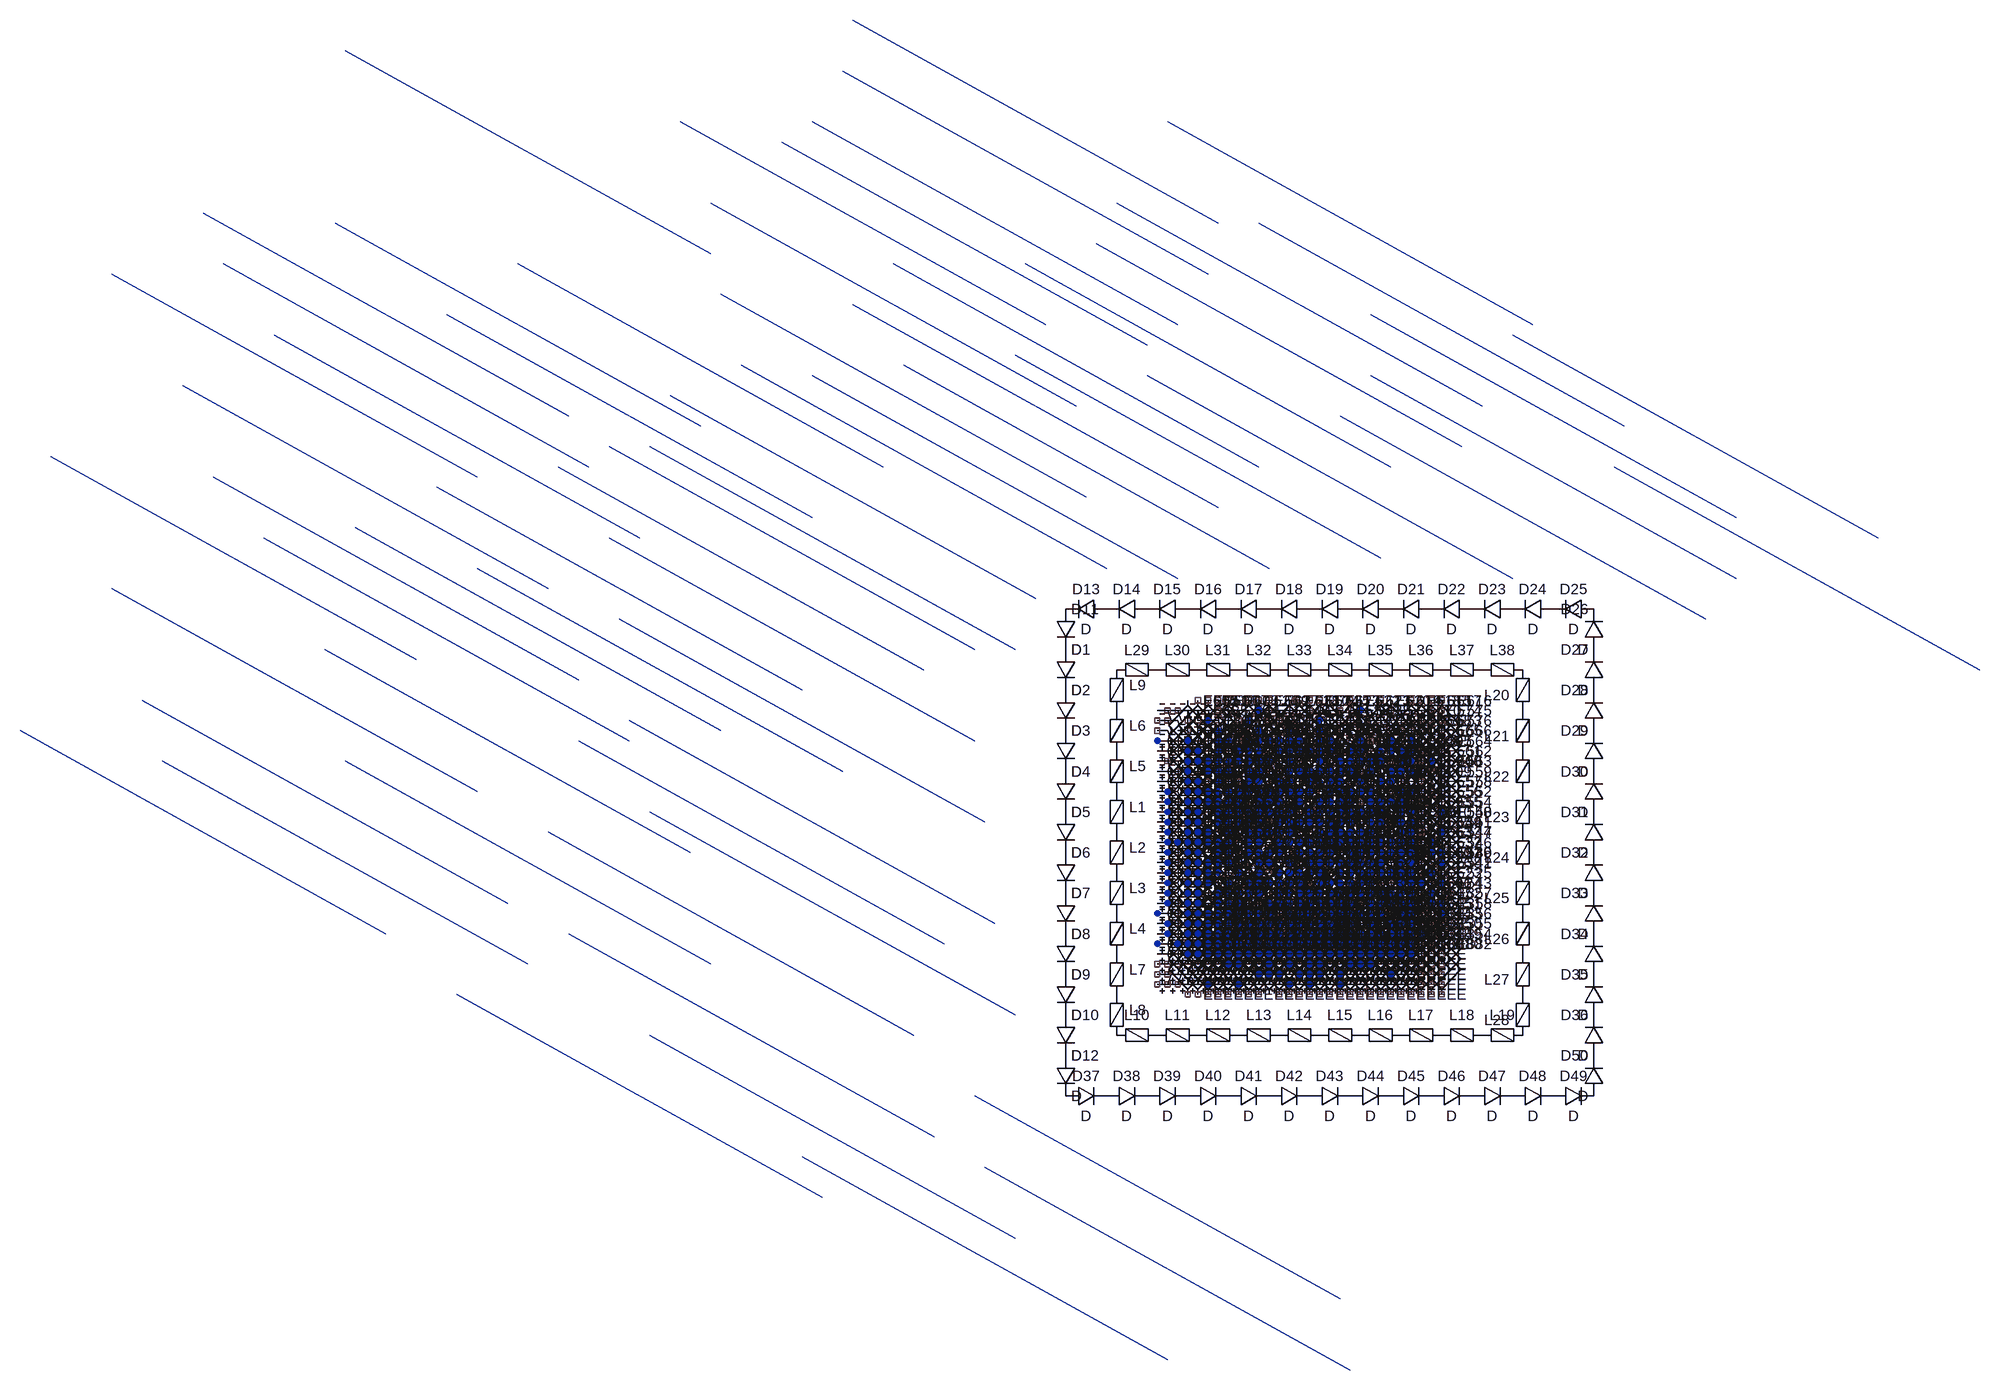
[diagram p0: schematic LT Spice Art.asc]
* LT Spice Art.asc
E1 P001 P002 NC_01 P003 E
E2 P004 P005 P006 P007 E
E3 P008 P009 P010 P011 E
E4 P012 P013 P014 P015 E
E5 P016 P017 P018 P019 E
E6 P020 P021 P022 P016 E
E7 P023 P024 P025 P026 E
E8 P027 P028 P029 P030 E
E9 P031 P032 P016 P033 E
E10 P034 P035 P036 P037 E
E11 P038 P039 NC_02 P040 E
E12 P041 P042 P043 P044 E
E13 P045 P046 P047 P048 E
E14 P049 P050 P051 P052 E
E15 P053 P054 P055 P056 E
E16 P057 P058 P059 P060 E
E17 P061 P062 P063 P064 E
E18 P065 P066 P067 P068 E
E19 P069 P010 P070 P071 E
E20 P029 P072 P073 P035 E
E21 P051 P074 P075 P076 E
E22 P042 P077 P078 P079 E
E23 P036 P080 P081 P082 E
E24 P035 P083 P080 P084 E
E25 P058 P085 P086 P022 E
E26 P039 P087 P088 P089 E
E27 P082 P090 P091 P092 E
E28 P040 P089 P093 P094 E
E29 P059 P086 P077 P095 E
E30 P019 P096 P097 P098 E
E31 P099 P100 P101 P102 E
E32 P103 P104 P098 P043 E
E33 P105 P095 P079 P106 E
E34 P107 P069 P108 P109 E
E35 P110 P111 P037 P112 E
E36 P113 P020 P060 P114 E
E37 P115 P109 P103 P041 E
E38 P116 P076 P038 P117 E
E39 P048 P118 P119 P120 E
E40 P121 P122 P106 P123 E
E41 P124 P125 P126 P127 E
E42 P128 P129 P130 P131 E
E43 P132 P133 P134 P135 E
E44 P124 P125 P126 P127 E
E45 P115 P109 P103 P041 E
E46 P136 P052 P116 P137 E
E47 P138 P139 P110 P140 E
E48 P141 P114 P121 P142 E
E49 P143 P112 P144 P132 E
E50 P127 P145 P129 P146 E
E51 P147 P019 P148 P149 E
E52 P117 P150 P040 P126 E
E53 P151 P120 P152 P153 E
E54 P123 P148 P154 P155 E
E55 P156 P094 P157 P130 E
E56 P044 P079 P158 P159 E
E57 P160 P161 P102 P162 E
E58 P163 P119 P164 P152 E
E59 P099 P100 P101 P102 E
E60 P043 P078 P165 P158 E
E61 P129 P166 P167 P168 E
E62 P152 P169 P170 P171 E
E63 P106 P172 P173 P154 E
E64 P174 P082 P175 P176 E
E65 P043 P078 P165 P158 E
E66 P169 P177 P178 P179 E
E67 P166 P180 P181 P182 E
E68 P078 P183 P184 P185 E
E69 P015 P186 P180 P187 E
E70 P015 P186 P180 P187 E
E71 P018 P188 P189 P097 E
E72 P084 P190 P090 P191 E
E73 P071 P192 P193 P077 E
E74 P071 P192 P193 P077 E
E75 P194 P195 P190 P196 E
E76 P194 P195 P190 P196 E
E77 P021 P197 P198 P017 E
E78 P025 P199 P200 P201 E
E79 P074 P202 P203 P063 E
E80 P204 P205 P206 P207 E
E81 P208 P209 P210 P211 E
E82 P212 P213 P202 P062 E
E83 P214 P215 P216 P199 E
E84 P214 P215 P216 P199 E
E85 P217 P218 P209 P214 E
E86 P219 P220 P221 P204 E
E87 P212 P213 P202 P062 E
E88 P222 P223 P224 P225 E
E89 P226 P227 P228 P219 E
E90 P229 P230 P009 P231 E
E91 P232 P233 P229 P005 E
E92 P234 P235 P214 P024 E
E93 P236 P208 P237 P238 E
E94 P239 P222 P240 P241 E
E95 P242 P217 P208 P243 E
E96 P244 P219 P245 P246 E
E97 P247 NC_03 P028 P236 E
E98 P027 P028 P029 P030 E
E99 P050 P212 P074 P061 E
E100 P248 P249 P024 P250 E
E101 P251 P252 P246 P253 E
E102 P253 P254 P046 P255 E
E103 P068 P008 P069 P256 E
E104 P006 P231 P011 P058 E
E105 P257 P258 P085 P021 E
E106 P257 P258 P085 P021 E
E107 P257 P258 P085 P021 E
E108 P032 P259 P017 P108 E
E109 P026 P260 P201 P002 E
E110 P246 P204 NC_04 P046 E
E111 P030 P237 P035 P111 E
E112 P261 P245 P064 P262 E
E113 P263 P243 P238 P054 E
E114 P264 P023 P054 P265 E
E115 P266 P261 P267 P268 E
E116 P265 P026 P269 P001 E
E117 P270 P271 P020 P031 E
E118 P272 P273 P068 P274 E
E119 P275 P276 P244 P251 E
E120 P277 P278 P241 P065 E
E121 P279 P280 P066 P273 E
E122 P281 P282 P252 P283 E
E123 P284 P285 P050 P286 E
E124 P287 P288 P286 P289 E
E125 P290 P284 P049 P291 E
E126 P292 P251 P293 P294 E
E127 P295 P113 P296 P141 E
E128 P297 P115 P298 P299 E
E129 P300 P127 P128 P301 E
E130 P302 P123 P303 P304 E
E131 P305 P152 P306 P307 E
E132 P308 P038 P120 P309 E
E133 P310 P255 P048 P308 E
E134 P311 P031 P114 P312 E
E135 P313 P117 P309 P314 E
E136 P315 P316 P001 P317 E
E137 P318 P319 P263 P264 E
E138 P320 P004 P274 P321 E
E139 P322 P263 P139 P053 E
E140 P323 P324 P325 P138 E
E141 P326 P293 P268 P327 E
E142 P328 P116 P308 P313 E
E143 P329 P001 P330 P331 E
E144 P332 P333 P041 P334 E
E145 P312 P033 P147 P298 E
E146 P317 P034 P003 P335 E
E147 P336 P196 P191 P337 E
E148 P035 P083 P080 P084 E
E149 P237 P210 P083 P194 E
E150 P194 P195 P190 P196 E
E151 P010 P338 P339 P192 E
E152 P192 P340 P341 P342 E
E153 P193 P341 P343 P183 E
E154 P344 P345 P346 P347 E
E155 P196 P348 P349 P344 E
E156 P350 P351 P352 P014 E
E157 P200 P353 P348 P354 E
E158 P355 P356 P357 P010 E
E159 P228 P358 P359 P221 E
E160 P360 P361 P220 P362 E
E161 P363 P364 P365 P240 E
E162 P276 P360 P219 P252 E
E163 P366 P367 P368 P369 E
E164 P081 P370 P369 P091 E
E165 P371 P372 P373 P374 E
E166 P093 P375 P376 P377 E
E167 P086 P378 P342 P379 E
E168 P202 P380 P381 P382 E
E169 P220 P383 P384 P205 E
E170 P385 P346 P374 NC_05 E
E171 P161 P081 P386 P175 E
E172 P123 P148 P154 P155 E
E173 P387 P388 P127 P389 E
E174 P265 P026 P269 P001 E
E175 P107 P069 P108 P109 E
E176 P046 P207 P390 P118 E
E177 P391 P200 P196 NC_06 E
E178 P012 P013 P014 P015 E
E179 P194 P195 P190 P196 E
E180 P073 P392 P393 P080 E
E181 P207 P394 P395 P396 E
E182 P085 P397 P378 P198 E
E183 P199 P398 P353 P399 E
E184 P221 P384 P400 P206 E
E185 P202 P380 P381 P382 E
E186 P401 P402 P398 P403 E
E187 P235 P404 P215 P401 E
E188 P405 P406 P407 P230 E
E189 P408 P409 P410 P411 E
E190 P411 P407 P356 P009 E
E191 P412 P413 P414 P415 E
E192 P248 P249 P024 P250 E
E193 P263 P243 P238 P054 E
E194 P253 P254 P046 P255 E
E195 P267 P064 P150 P125 E
E196 P114 P016 P122 P147 E
E197 P047 P390 P015 P119 E
E198 P016 P017 P018 P019 E
E199 P316 P029 P002 P034 E
E200 P324 P236 P030 P139 E
E201 P291 P286 P052 P266 E
E202 P416 P417 P270 P418 E
E203 P419 P420 P324 P322 E
E204 P290 P284 P049 P291 E
E205 P421 P422 P423 P416 E
E206 P421 P422 P423 P416 E
E207 P424 P425 P426 P419 E
E208 P427 P428 P284 P287 E
E209 P429 P430 P431 P426 E
E210 P432 P433 P242 P319 E
E211 P434 P435 P436 P050 E
E212 P254 P437 P207 P075 E
E213 P350 P351 P352 P014 E
E214 P393 P438 P367 P370 E
E215 P192 P340 P341 P342 E
E216 P206 P439 P440 P395 E
E217 P013 P440 P441 P186 E
E218 P344 P345 P346 P347 E
E219 P097 P442 P443 P444 E
E220 P174 P082 P175 P176 E
E221 P127 P145 P129 P146 E
E222 P298 P103 P149 P445 E
E223 P446 P121 P447 P302 E
E224 P446 P121 P447 P302 E
E225 P331 P003 P160 P448 E
E226 P449 P156 P450 P451 E
E227 P452 P153 P307 P453 E
E228 P109 P071 P104 P042 E
E229 P060 P022 P095 P122 E
E230 P037 P084 P082 P454 E
E231 P103 P104 P098 P043 E
E232 P133 P337 P455 P456 E
E233 P144 P454 P176 P134 E
E234 P445 P043 P457 P458 E
E235 P459 P102 P460 NC_07 E
E236 P132 P133 P134 P135 E
E237 P461 P309 P153 P449 E
E238 P462 P160 P459 P463 E
E239 P301 P146 P131 P464 E
E240 P465 P325 P317 P466 E
E241 P467 P468 P310 P328 E
E242 NC_08 P264 P053 P469 E
E243 P470 P426 NC_09 P323 E
E244 P471 NC_10 P264 P472 E
E245 P473 P065 P474 P475 E
E246 P272 P273 P068 P274 E
E247 P476 P434 P283 P049 E
E248 P287 P288 P286 P289 E
E249 P477 P281 P251 P478 E
E250 P325 P030 P034 P110 E
E251 P274 P006 P256 P057 E
E252 P274 P006 P256 P057 E
E253 P110 P111 P037 P112 E
E254 P055 P391 P336 NC_11 E
E255 P034 P035 P036 P037 E
E256 P032 P259 P017 P108 E
E257 P058 P085 P086 P022 E
E258 P390 P395 P186 P479 E
E259 P104 P193 P480 P078 E
E260 P095 P379 P481 P172 E
E261 P479 P482 P483 P177 E
E262 P354 P484 P345 P366 E
E263 P198 P485 P486 P188 E
E264 P083 P487 P488 P190 E
E265 P221 P384 P400 P206 E
E266 P258 P489 P397 P197 E
E267 P490 P491 P492 P210 E
E268 P235 P404 P215 P401 E
E269 P228 P358 P359 P221 E
E270 P355 P356 P357 P010 E
E271 P221 P384 P400 P206 E
E272 P231 P493 P494 P085 E
E273 P204 P205 P206 P207 E
E274 P062 P359 P382 P495 E
E275 P437 P496 P394 P203 E
E276 P072 P492 P392 P083 E
E277 P211 P216 P195 P200 E
E278 P260 P403 P399 P073 E
E279 P011 P494 P192 P086 E
E280 P085 P397 P378 P198 E
E281 P259 P357 P497 P070 E
E282 P083 P487 P488 P190 E
E283 P070 P339 P498 P193 E
E284 P354 P484 P345 P366 E
E285 P354 P484 P345 P366 E
E286 P193 P341 P343 P183 E
E287 P088 P499 P500 P375 E
E288 P189 P501 P502 P443 E
E289 P347 P368 NC_12 P503 E
E290 P371 P372 P373 P374 E
E291 P180 P504 P505 P506 E
E292 P375 P507 P508 P509 E
E293 P183 P510 P511 P512 E
E294 P090 P513 P514 P371 E
E295 P186 P515 P504 P483 E
E296 P188 P516 P501 P442 E
E297 P190 P517 P513 P349 E
E298 P087 P518 P499 P352 E
E299 P083 P487 P488 P190 E
E300 P399 P519 P484 P393 E
E301 P206 P439 P440 P395 E
E302 P010 P338 P339 P192 E
E303 P203 P381 P520 P087 E
E304 P495 P400 P351 P013 E
E305 P396 P520 P482 P088 E
E306 P080 P488 P370 P090 E
E307 P379 P486 P521 P189 E
E308 P014 P441 P522 P180 E
E309 P480 P343 P523 P184 E
E310 P177 P500 P524 P376 E
E311 P091 P514 P525 NC_13 E
E312 P386 P369 P503 NC_14 E
E313 P187 P483 P506 P178 E
E314 P526 P522 P509 P181 E
E315 P481 P521 P512 P527 E
E316 P089 P352 P375 P526 E
E317 P077 P342 P183 P481 E
E318 P096 P498 P442 P480 E
E319 P191 P349 P371 P385 E
E320 P063 P382 P087 P350 E
E321 P208 P209 P210 P211 E
E322 P528 P529 P197 P259 E
E323 P074 P202 P203 P063 E
E324 P249 P530 P401 P531 E
E325 P435 P532 P415 P212 E
E326 P533 P534 P213 P228 E
E327 P233 P535 P230 P365 E
E328 P225 P410 P529 P355 E
E329 P362 P414 P205 P437 E
E330 P231 P493 P494 P085 E
E331 P531 P536 P403 P072 E
E332 P365 P537 P493 P258 E
E333 P538 P539 P536 P490 E
E334 P227 P540 P358 P220 E
E335 NC_15 NC_16 P539 P541 E
E336 P364 P542 P537 P224 E
E337 P532 P543 P544 P213 E
E338 P541 P545 P491 P209 E
E339 P224 P546 P489 P529 E
E340 P415 P544 P496 P202 E
E341 P009 P547 P338 P494 E
E342 P210 P548 P487 P195 E
E343 P197 P549 P485 P497 E
E344 P550 NC_17 P218 P235 E
E345 P551 NC_18 P530 P538 E
E346 P552 P553 P235 P249 E
E347 NC_19 P554 P541 P217 E
E348 P553 NC_20 P404 P530 E
E349 P555 NC_21 P540 P361 E
E350 P556 NC_22 P413 P532 E
E351 P557 NC_23 P361 P412 E
E352 P558 P559 P532 P533 E
E353 P560 NC_24 P534 P227 E
E354 P561 NC_25 P542 P223 E
E355 P562 NC_26 P409 P405 E
E356 P563 NC_27 P535 P364 E
E357 P564 P565 P405 P233 E
E358 P566 NC_28 P223 P408 E
E359 P369 NC_29 NC_30 P525 E
E360 P483 NC_31 P567 P524 E
E361 P442 NC_32 P568 P523 E
E362 P349 NC_33 P372 P346 E
E363 P352 NC_34 P507 P522 E
E364 P342 NC_35 P510 P521 E
E365 P393 P438 P367 P370 E
E366 P395 NC_36 P515 P482 E
E367 P382 NC_37 P518 P351 E
E368 P195 NC_38 P517 P348 E
E369 P497 NC_39 P516 P498 E
E370 P494 NC_40 P340 P378 E
E371 P403 NC_41 P519 P392 E
E372 P205 NC_42 P439 P394 E
E373 P529 NC_43 P549 P357 E
E374 P209 NC_44 P548 P216 E
E375 P230 NC_45 P547 P493 E
E376 P213 NC_46 P380 P359 E
E377 P530 NC_47 P402 P536 E
E378 P223 NC_48 P546 P410 E
E379 P361 NC_49 P383 P414 E
E380 P559 NC_50 P543 P534 E
E381 P554 NC_51 P545 P218 E
E382 P565 NC_52 P406 P535 E
E383 P176 P092 P569 P570 E
E384 P129 P166 P167 P168 E
E385 P162 P175 NC_53 NC_54 E
E386 P456 P101 NC_55 P460 E
E387 P176 P092 P569 P570 E
E388 P152 P169 P170 P171 E
E389 P134 P455 P570 NC_56 E
E390 P123 P148 P154 P155 E
E391 P146 P164 P168 P306 E
E392 P126 P571 P094 P129 E
E393 P145 P015 P166 P164 E
E394 P335 P037 P174 P144 E
E395 P033 P108 P019 P103 E
E396 P572 P135 P573 P574 E
E397 P575 P459 P576 P577 E
E398 P578 P303 P579 P580 E
E399 P452 P153 P307 P453 E
E400 P572 P135 P573 P574 E
E401 NC_57 P307 P581 NC_58 E
E402 P452 P153 P307 P453 E
E403 P582 P151 P305 P452 E
E404 NC_59 P583 P132 NC_60 E
E405 P584 P308 P151 P461 E
E406 P387 P388 P127 P389 E
E407 P297 P115 P298 P299 E
E408 P585 P056 P583 P586 E
E409 P329 P001 P330 P331 E
E410 P295 P113 P296 P141 E
E411 P587 P588 P312 P297 E
E412 P589 P310 P590 P584 E
E413 P591 P334 P592 P593 E
E414 P462 P160 P459 P463 E
E415 P314 P126 P156 P128 E
E416 P388 P047 P145 P163 E
E417 P109 P071 P104 P042 E
E418 P111 P194 P084 P336 E
E419 P051 P074 P075 P076 E
E420 P068 P008 P069 P256 E
E421 P244 P219 P245 P246 E
E422 P273 P229 P008 P006 E
E423 P273 P229 P008 P006 E
E424 P065 P066 P067 P068 E
E425 P004 P005 P006 P007 E
E426 P004 P005 P006 P007 E
E427 P004 P005 P006 P007 E
E428 P004 P005 P006 P007 E
E429 P417 P241 P271 P474 E
E430 P417 P241 P271 P474 E
E431 P417 P241 P271 P474 E
E432 P049 P050 P051 P052 E
E433 P049 P050 P051 P052 E
E434 P049 P050 P051 P052 E
E435 P049 P050 P051 P052 E
E436 P416 P417 P270 P418 E
E437 P594 P423 P321 P595 E
E438 P596 P322 P138 P597 E
E439 P598 P475 P588 P599 E
E440 P600 P478 P294 P467 E
E441 P601 P321 P602 P295 E
E442 P465 P325 P317 P466 E
E443 P587 P588 P312 P297 E
E444 P603 P602 P332 P604 E
E445 P605 P312 P142 P606 E
E446 P607 P590 P389 P582 E
E447 P608 P132 P609 P572 E
E448 P582 P151 P305 P452 E
E449 P446 P121 P447 P302 E
E450 P142 P147 P123 P610 E
E451 P334 P105 P044 P447 E
E452 P334 P105 P044 P447 E
E453 P447 P106 P159 P303 E
E454 P610 P149 P155 P611 E
E455 P301 P146 P131 P464 E
E456 P452 P153 P307 P453 E
E457 P612 NC_61 NC_62 P613 E
E458 NC_63 P131 P614 P615 E
E459 P304 P155 P616 NC_64 E
E460 P575 P459 P576 P577 E
E461 P617 P458 P618 P619 E
E462 P453 P450 P620 P621 E
E463 P464 P306 P622 P581 E
E464 P451 P130 P623 P614 E
E465 P307 P171 P624 P620 E
E466 P131 P168 P625 P622 E
E467 P303 P154 P626 P616 E
E468 P611 P457 P627 P618 E
E469 P628 P159 P629 P579 E
E470 P303 P154 P626 P616 E
E471 P458 P158 P630 P629 E
E472 P458 P158 P630 P629 E
E473 P155 P631 P632 P627 E
E474 P155 P631 P632 P627 E
E475 P159 P173 P633 P626 E
E476 P457 P165 P634 P630 E
E477 P457 P165 P634 P630 E
E478 P457 P165 P634 P630 E
E479 P154 P635 P636 P632 E
E480 P154 P635 P636 P632 E
E481 P158 P185 P637 P633 E
E482 P158 P185 P637 P633 E
E483 P158 P185 P637 P633 E
E484 P158 P185 P637 P633 E
E485 P631 P444 P638 P634 E
E486 P631 P444 P638 P634 E
E487 P631 P444 P638 P634 E
E488 P631 P444 P638 P634 E
E489 P173 P527 P639 P636 E
E490 P173 P527 P639 P636 E
E491 P173 P527 P639 P636 E
E492 P173 P527 P639 P636 E
E493 P173 P527 P639 P636 E
E494 P635 P443 P640 P638 E
E495 P185 P512 P641 P639 E
E496 P635 P443 P640 P638 E
E497 P165 P184 P642 P637 E
E498 P444 P523 P643 P642 E
E499 P184 P511 NC_65 P641 E
E500 P527 P502 P644 P640 E
E501 P443 P568 NC_66 P643 E
E502 P512 NC_67 NC_68 P644 E
E503 P450 P157 P645 P623 E
E504 P306 P170 P646 P624 E
E505 P130 P167 P647 P625 E
E506 P171 P179 P648 P645 E
E507 P157 P377 P649 P647 E
E508 P154 P635 P636 P632 E
E509 P168 P182 P650 P646 E
E510 P170 P178 P651 P648 E
E511 P167 P181 P652 P650 E
E512 P179 P376 P653 P649 E
E513 P182 P506 P654 P651 E
E514 P178 P524 P655 P653 E
E515 P185 P512 P641 P639 E
E516 P377 P509 P656 P652 E
E517 P178 P524 P655 P653 E
E518 P181 P505 P657 P654 E
E519 P376 P508 NC_69 P656 E
E520 P506 P567 NC_70 P655 E
E521 P509 NC_71 NC_72 P657 E
E522 P658 P557 P360 P282 E
E523 P659 P556 P412 P435 E
E524 P660 P555 P227 P360 E
E525 P661 P562 P408 P280 E
E526 P433 P550 P217 P234 E
E527 P282 P412 P362 P436 E
E528 P662 P228 P062 P245 E
E529 P241 P225 P528 P067 E
E530 P663 P551 P249 P664 E
E531 P658 P557 P360 P282 E
E532 P665 P558 P435 P285 E
E533 P666 P660 P226 P276 E
E534 P667 P659 P282 P434 E
E535 P430 NC_73 P664 P247 E
E536 P288 P226 P662 P244 E
E537 P665 P558 P435 P285 E
E538 NC_74 P560 P533 P226 E
E539 P668 P566 P222 P278 E
E540 P668 P566 P222 P278 E
E541 P669 P563 P233 P363 E
E542 P669 P563 P233 P363 E
E543 P670 P561 P364 P222 E
E544 P671 P670 P363 P239 E
E545 P668 P566 P222 P278 E
E546 P672 P564 P280 P232 E
E547 P671 P670 P363 P239 E
E548 P673 P669 P232 P674 E
E549 P667 P659 P282 P434 E
E550 P673 P669 P232 P674 E
E551 P675 P661 P278 P279 E
E552 P676 P672 P279 P677 E
E553 P673 P669 P232 P674 E
E554 P678 P668 P239 P277 E
E555 P679 P658 P276 P281 E
E556 NC_75 P665 P434 P284 E
E557 P680 P666 P288 P275 E
E558 P681 P671 P674 P422 E
E559 P682 P675 P277 P683 E
E560 P427 P428 P284 P287 E
E561 P684 P679 P275 P477 E
E562 P685 P678 P422 P686 E
E563 P687 P673 P677 P688 E
E564 NC_76 P676 P683 P689 E
E565 NC_77 P680 P287 P690 E
E566 NC_78 P681 P688 P421 E
E567 NC_79 NC_80 P318 P471 E
E568 NC_81 P429 NC_82 P470 E
E569 P691 P688 P320 P594 E
E570 P692 P686 P416 P693 E
E571 P694 P477 P292 P600 E
E572 P695 P287 P291 NC_83 E
E573 NC_84 NC_85 P477 NC_86 E
E574 NC_87 P427 P290 P695 E
E575 NC_88 P687 P689 P691 E
E576 NC_89 P682 P686 NC_90 E
E577 P693 P473 P418 P598 E
E578 P696 P320 P697 P601 E
E579 P698 P418 P311 P587 E
E580 NC_91 P294 P327 P589 E
E581 P597 P053 P140 P585 E
E582 P604 P296 P334 P446 E
E583 P606 P298 P610 NC_92 E
E584 P699 P610 P304 NC_93 E
E585 P700 P628 P619 NC_94 E
E586 P701 P451 P621 NC_95 E
E587 P593 P447 P628 P578 E
E588 P313 P117 P309 P314 E
E589 P045 P046 P047 P048 E
E590 P322 P263 P139 P053 E
E591 P552 P553 P235 P249 E
E592 P658 P557 P360 P282 E
E593 NC_96 P663 P248 P431 E
E594 NC_97 P432 P420 P318 E
E595 P424 P425 P426 P419 E
E596 P263 P243 P238 P054 E
E597 P007 P257 P058 P020 E
E598 P264 P023 P054 P265 E
E599 P418 P474 P031 P588 E
E600 P326 P293 P268 P327 E
E601 P599 P702 P115 P332 E
E602 P313 P117 P309 P314 E
E603 P586 P330 NC_98 P462 E
E604 P300 P127 P128 P301 E
E605 P703 P464 P615 P704 E
E606 NC_99 P609 P613 NC_100 E
E607 NC_101 P449 P453 P701 E
E608 NC_102 P592 P617 P700 E
E609 NC_103 P142 P302 P699 E
E610 NC_104 P329 P586 NC_105 E
E611 P705 P332 P299 P591 E
E612 P706 P138 P466 P707 E
E613 P708 P472 P469 P709 E
E614 P710 P419 P323 P596 E
E615 NC_106 NC_107 P471 NC_108 E
E616 NC_109 P685 P421 P692 E
E617 NC_110 P684 P690 P694 E
E618 NC_111 P689 NC_112 P696 E
E619 P710 P419 P323 P596 E
E620 NC_113 P416 P595 P698 E
E621 P708 P472 P469 P709 E
E622 NC_114 P697 P599 P603 E
E623 P706 P138 P466 P707 E
E624 NC_115 P327 P387 P607 E
E625 NC_116 P311 P141 P605 E
E626 NC_117 P389 P301 NC_118 E
E627 NC_119 P143 NC_120 P608 E
E628 P705 P332 P299 P591 E
E629 P079 P481 P185 P173 E
E630 P571 P014 P526 P166 E
E631 P021 P197 P198 P017 E
E632 P064 P495 P350 P012 E
E633 P026 P260 P201 P002 E
E634 P435 P532 P415 P212 E
E635 P436 P415 P437 P074 E
E636 P241 P225 P528 P067 E
E637 P315 P316 P001 P317 E
E638 P266 P261 P267 P268 E
E639 P478 P283 P253 P468 E
E640 P275 P276 P244 P251 E
E641 P476 P434 P283 P049 E
E642 P420 P242 P236 P263 E
E643 P288 P226 P662 P244 E
E644 P232 P233 P229 P005 E
E645 NC_121 P137 P313 NC_122 E
E646 P602 P057 P333 P296 E
E647 P268 P262 P125 P388 E
E648 P296 P060 P105 P121 E
E649 P697 P274 P702 P602 E
E650 NC_123 P049 P468 P136 E
E651 NC_124 P304 P580 NC_125 E
E652 P703 P464 P615 P704 E
E653 NC_126 P448 P463 P612 E
E654 P461 P309 P153 P449 E
E655 P047 P390 P015 P119 E
E656 P076 P063 P039 P150 E
E657 P026 P260 P201 P002 E
E658 P253 P254 P046 P255 E
E659 P474 P067 P032 P107 E
E660 NC_127 P250 P026 P316 E
E661 P324 P236 P030 P139 E
E662 P277 P278 P241 P065 E
E663 NC_128 P552 P234 P248 E
L1 P711 P712
L2 P712 P713
L3 P713 P714
L4 P714 P715
L5 P716 P711
L6 P717 P716
L7 P715 P718
L8 P718 P719
L9 P720 P717
L10 P721 P719
L11 P722 P721
L12 P723 P722
L13 P724 P723
L14 P725 P724
L15 P726 P725
L16 P727 P726
L17 P728 P727
L18 P729 P728
L19 P730 P729
L20 P731 P732
L21 P733 P731
L22 P734 P733
L23 P735 P734
L24 P736 P735
L25 P737 P736
L26 P738 P737
L27 P739 P738
L28 P730 P739
L29 P740 P720
L30 P741 P740
L31 P742 P741
L32 P743 P742
L33 P744 P743
L34 P745 P744
L35 P746 P745
L36 P747 P746
L37 P748 P747
L38 P732 P748
D1 P749 P750 D
D2 P750 P751 D
D3 P751 P752 D
D4 P752 P753 D
D5 P753 P754 D
D6 P754 P755 D
D7 P755 P756 D
D8 P756 P757 D
D9 P757 P758 D
D10 P758 P759 D
D11 P760 P749 D
D12 P759 P761 D
D13 P762 P760 D
D14 P763 P762 D
D15 P764 P763 D
D16 P765 P764 D
D17 P766 P765 D
D18 P767 P766 D
D19 P768 P767 D
D20 P769 P768 D
D21 P770 P769 D
D22 P771 P770 D
D23 P772 P771 D
D24 P773 P772 D
D25 P774 P773 D
D26 P775 P774 D
D27 P776 P775 D
D28 P777 P776 D
D29 P778 P777 D
D30 P779 P778 D
D31 P780 P779 D
D32 P781 P780 D
D33 P782 P781 D
D34 P783 P782 D
D35 P784 P783 D
D36 P785 P784 D
D37 P761 P786 D
D38 P786 P787 D
D39 P787 P788 D
D40 P788 P789 D
D41 P789 P790 D
D42 P790 P791 D
D43 P791 P792 D
D44 P792 P793 D
D45 P793 P794 D
D46 P794 P795 D
D47 P795 P796 D
D48 P796 P797 D
D49 P797 P798 D
D50 P798 P785 D
.model D D
.lib standard.dio
.backanno
.end